# EAGLE design MCS8951 (EAGLE 7.2.0)
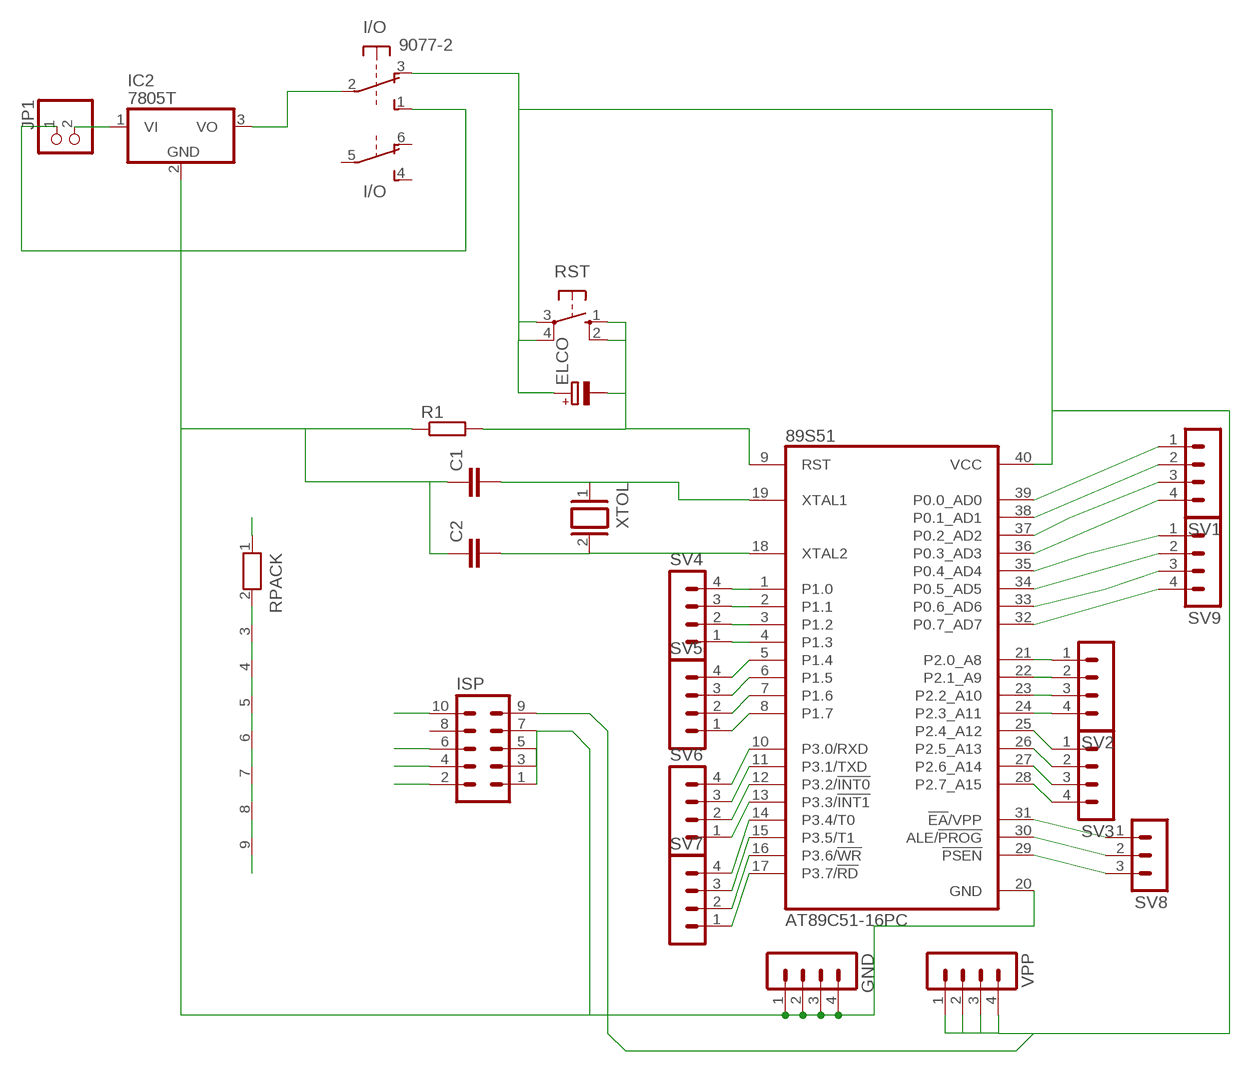
[diagram p0: schematic, sheet 1]

## Parts
89S51  AT89C51-16PC  [DIL40]
C1  C-EU025-030X050  [C025-030X050]
C2  C-EU025-030X050  [C025-030X050]
ELCO  CPOL-EUE5-5  [E5-5]
GND  MA04-1  [MA04-1]
I/O  9077-2  [9077-2]
IC2  7805T  [TO220H]
ISP  MA05-2  [MA05-2]
JP1  PINHD-1X2  [1X02]
R1  R-EU_0207/10  [0207/10]
RPACK  RN08  [RN-9]
RST  10-XX  [B3F-10XX]
SV1  MA04-1  [MA04-1]
SV2  MA04-1  [MA04-1]
SV3  MA04-1  [MA04-1]
SV4  MA04-1  [MA04-1]
SV5  MA04-1  [MA04-1]
SV6  MA04-1  [MA04-1]
SV7  MA04-1  [MA04-1]
SV8  MA03-1  [MA03-1]
SV9  MA04-1  [MA04-1]
VPP  MA04-1  [MA04-1]
XTOL  XTAL/S  [QS]

## Nets
GND: 89S51.20(GND) C1.1 C2.1 GND.1 GND.2 GND.3 GND.4 I/O.1(1:S) IC2.2(GND) ISP.1 ISP.3 ISP.5 ISP.7 JP1.1 R1.1
MISO: 89S51.7(P1.6) ISP.2 SV5.2
MOSI: 89S51.6(P1.5) ISP.10 SV5.3
N$2: I/O.2(1:P) IC2.3(VO)
N$4: 89S51.21(P2.0_A8) SV2.1
N$5: 89S51.22(P2.1_A9) SV2.2
N$6: 89S51.23(P2.2_A10) SV2.3
N$7: 89S51.24(P2.3_A11) SV2.4
N$8: 89S51.25(P2.4_A12) SV3.1
N$9: 89S51.26(P2.5_A13) SV3.2
N$10: 89S51.27(P2.6_A14) SV3.3
N$11: 89S51.28(P2.7_A15) SV3.4
N$12: 89S51.4(P1.3) SV4.1
N$13: 89S51.3(P1.2) SV4.2
N$14: 89S51.2(P1.1) SV4.3
N$15: 89S51.1(P1.0) SV4.4
N$19: 89S51.5(P1.4) SV5.4
N$20: 89S51.13(P3.3/!INT1) SV6.1
N$21: 89S51.12(P3.2/!INT0) SV6.2
N$22: 89S51.11(P3.1/TXD) SV6.3
N$23: 89S51.10(P3.0/RXD) SV6.4
N$24: 89S51.17(P3.7/!RD) SV7.1
N$25: 89S51.16(P3.6/!WR) SV7.2
N$26: 89S51.15(P3.5/T1) SV7.3
N$27: 89S51.14(P3.4/T0) SV7.4
N$28: 89S51.31(!EA!/VPP) SV8.1
N$29: 89S51.30(ALE/!PROG) SV8.2
N$30: 89S51.29(!PSEN) SV8.3
N$37: 89S51.19(XTAL1) C1.2 XTOL.1
N$39: IC2.1(VI) JP1.2
N$44: 89S51.18(XTAL2) C2.2 XTOL.2
R1: 89S51.39(P0.0_AD0) RPACK.2 SV1.1
R2: 89S51.38(P0.1_AD1) RPACK.3 SV1.2
R3: 89S51.37(P0.2_AD2) RPACK.4 SV1.3
R4: 89S51.36(P0.3_AD3) RPACK.5 SV1.4
R5: 89S51.35(P0.4_AD4) RPACK.6 SV9.1
R6: 89S51.34(P0.5_AD5) RPACK.7 SV9.2
R7: 89S51.33(P0.6_AD6) RPACK.8 SV9.3
R8: 89S51.32(P0.7_AD7) RPACK.9 SV9.4
RST: 89S51.9(RST) ELCO.- ISP.6 R1.2 RST.1(S) RST.2(S1)
SCK: 89S51.8(P1.7) ISP.4 SV5.1
VPP: 89S51.40(VCC) ELCO.+ I/O.3(1:O) ISP.9 RPACK.1 RST.3(P) RST.4(P1) VPP.1 VPP.2 VPP.3 VPP.4
Unconnected: I/O.4(2:S) I/O.5(2:P) I/O.6(2:O) ISP.8

## Library data of the parts
89S51 = atmel:AT89C51-*: 8-bit Microcontroller with 4K Bytes Flash Not Recommended for New Designs. Use AT89S51. Source: http://www.atmel.com/dyn/resources/prod_documents/doc0265.; OC_FARNELL: unknown; OC_NEWARK: unknown
C1 C2 = resistor:C-EU: CAPACITOR, European symbol
ELCO = rcl:CPOL-EU: POLARIZED CAPACITOR, European symbol
GND SV1-SV7 SV9 VPP = con-lstb:MA04-1: PIN HEADER; OC_FARNELL: unknown; OC_NEWARK: unknown
I/O = switch-misc:9077-2: MARQUARDT SWITCH 9077.0200 Distributor: Buerklin <https://www.buerklin.com/default.asp?event=ShowArtikel%2812G2822%29&l=d&jump=ArtNr_12G2822>
IC2 = linear:78*: Positive VOLTAGE REGULATOR Source: http://cache.national.com/ds/LM/LM78L05.pdf http://www.fairchildsemi.com/ds/LM/LM7805.pdf
ISP = con-lstb:MA05-2: PIN HEADER; OC_FARNELL: unknown; OC_NEWARK: unknown
JP1 = pinhead:PINHD-1X2: PIN HEADER
R1 = resistor:R-EU_: RESISTOR, European symbol
RPACK = resistor-net:RN08: RESISTOR NETWORK; OC_FARNELL: unknown; OC_NEWARK: unknown
RST = switch-omron:10-XX: OMRON SWITCH; MPN: B3F-1000; OC_FARNELL: 176432; OC_NEWARK: 36M3542
SV8 = con-lstb:MA03-1: PIN HEADER; OC_FARNELL: unknown; OC_NEWARK: unknown
XTOL = special:XTAL/S: CRYSTAL

## Net classes
0 default: width 0.406 mm

## Board
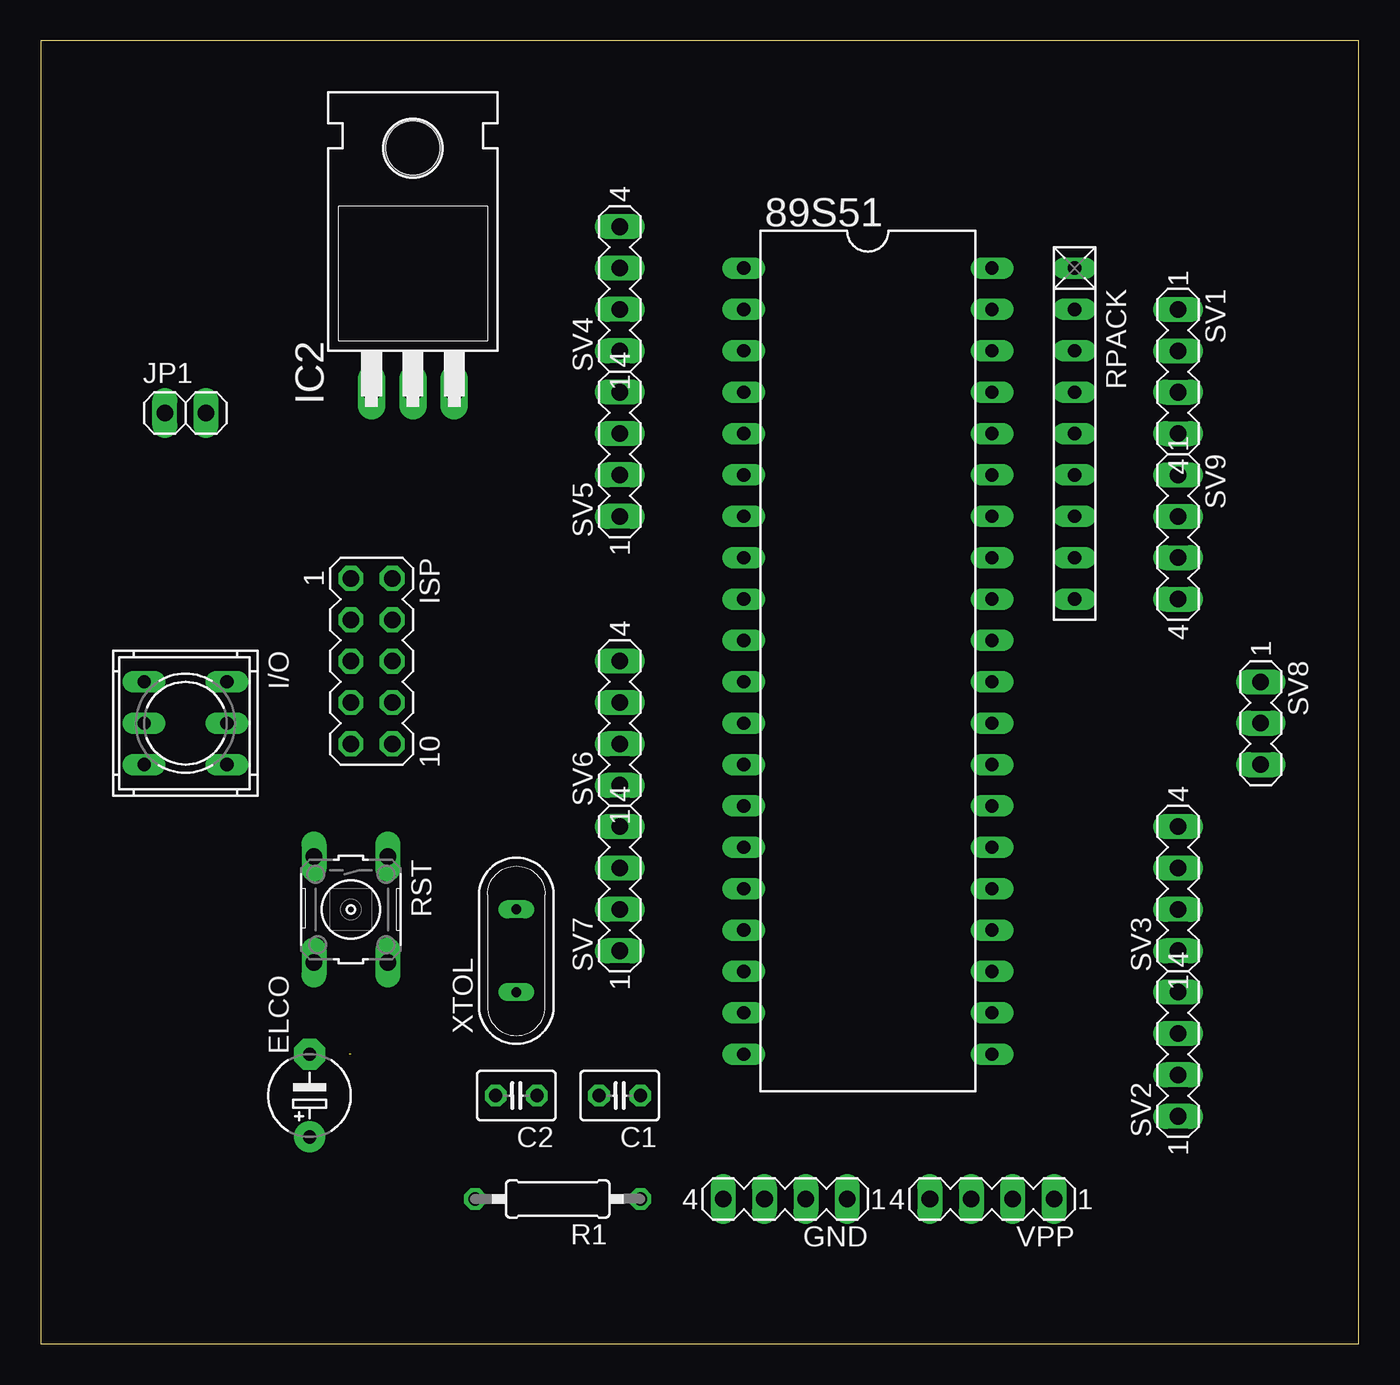
[diagram p1: board, top side]
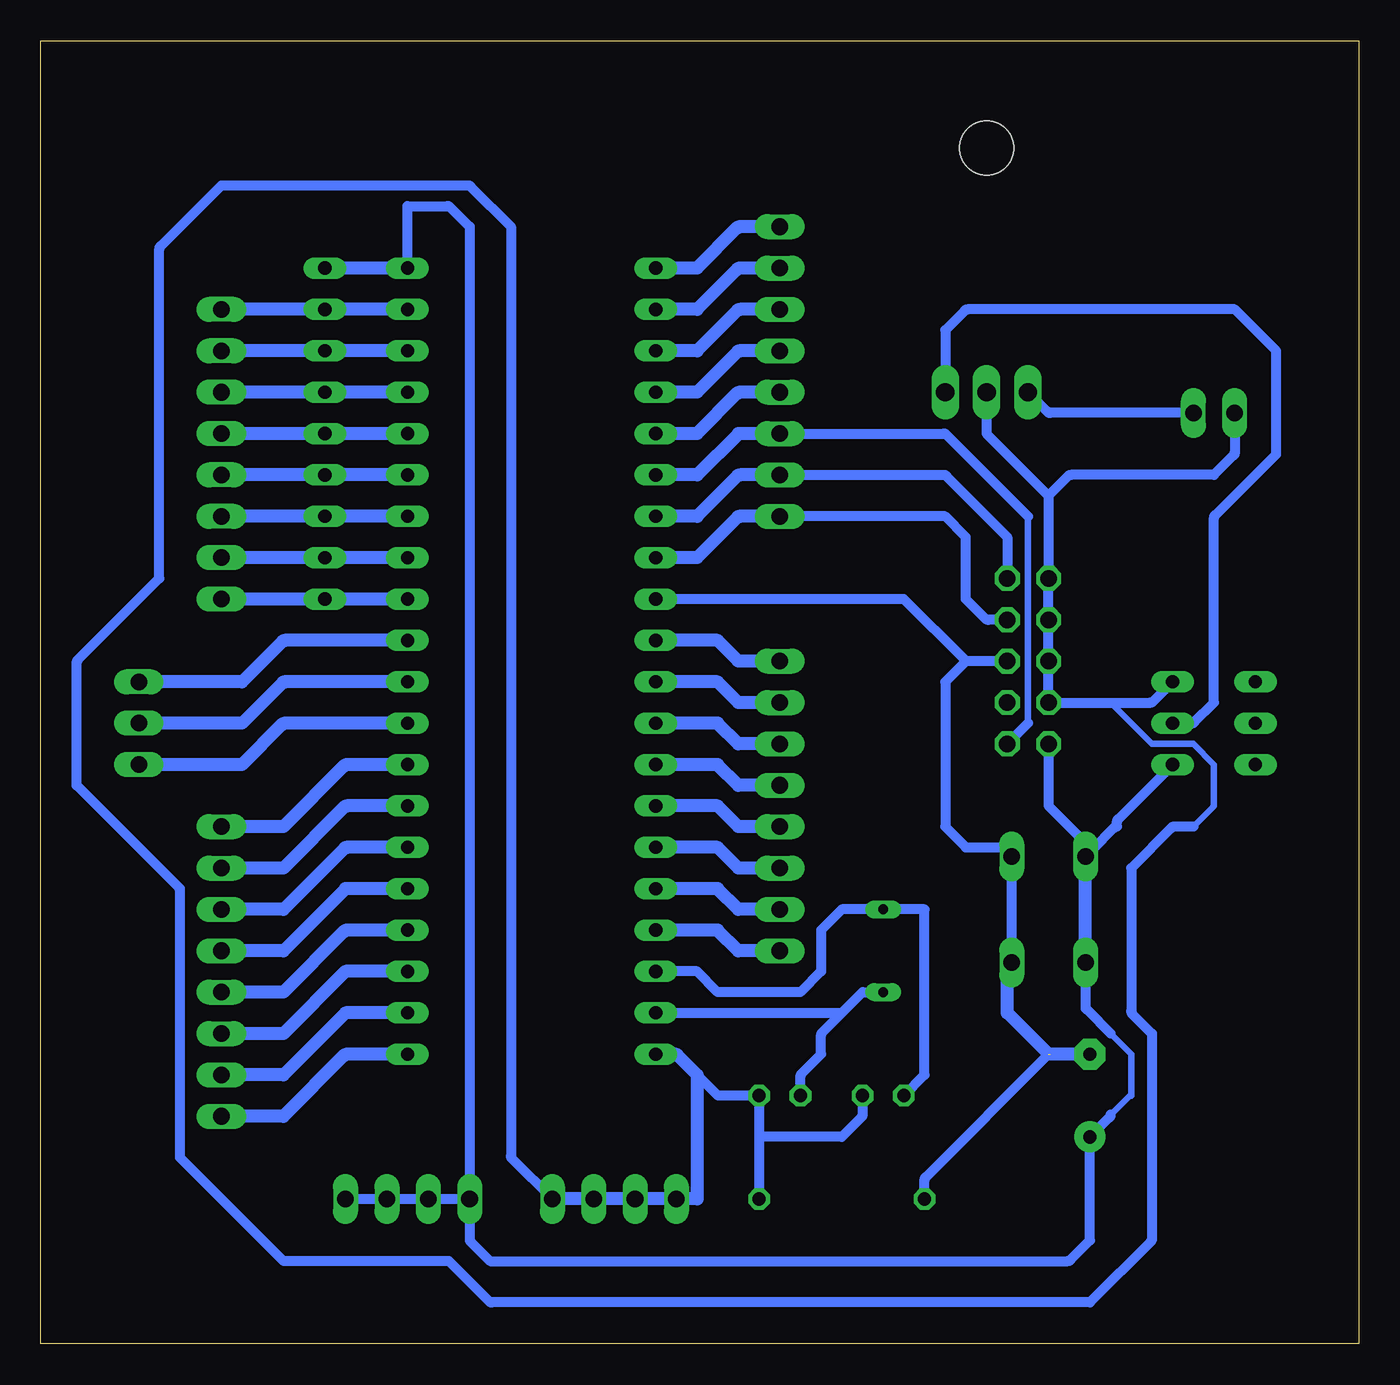
[diagram p2: board, bottom side, seen from below]

Size 80.95 x 80 mm. Coordinates in mm from the lower left corner, seen from the top.
Outline: 0,0 80.95,0 80.95,80 0,80 0,0
Copper layers (1*16): Top 0.035mm / dielectric 1.5mm / Bottom 0.035mm
Design rules "default": minimum track width 10mil, minimum drill 24mil, track to track 8mil, track to pad 8mil, pad to pad 8mil, via to via 8mil, smd to smd 8mil, copper to edge 40mil, drill to drill 8mil, minimum pad ring 10mil, minimum via ring 8mil, stop-mask expansion 4mil, vias tented up to drill 0mil, thermal gap 10mil

### Footprints (pad centres in the part's own frame; a part is rotated, then mirrored left to right if it is on the bottom)
DIL40 = drill 0.813 long: 1 -24.13,-7.62; 2 -21.59,-7.62; 3 -19.05,-7.62; 4 -16.51,-7.62; 5 -13.97,-7.62; 6 -11.43,-7.62; 7 -8.89,-7.62; 8 -6.35,-7.62; 9 -3.81,-7.62; 10 -1.27,-7.62; 11 1.27,-7.62; 12 3.81,-7.62; 13 6.35,-7.62; 14 8.89,-7.62; 15 11.43,-7.62; 16 13.97,-7.62; 17 16.51,-7.62; 18 19.05,-7.62; 19 21.59,-7.62; 20 24.13,-7.62; 21 24.13,7.62; 22 21.59,7.62; 23 19.05,7.62; 24 16.51,7.62; 25 13.97,7.62; 26 11.43,7.62; 27 8.89,7.62; 28 6.35,7.62; 29 3.81,7.62; 30 1.27,7.62; 31 -1.27,7.62; 32 -3.81,7.62; 33 -6.35,7.62; 34 -8.89,7.62; 35 -11.43,7.62; 36 -13.97,7.62; 37 -16.51,7.62; 38 -19.05,7.62; 39 -21.59,7.62; 40 -24.13,7.62
C025-030X050 = drill 0.813 octagon: 1 -1.27,0; 2 1.27,0
E5-5 = drill 0.813 pad 1.905: + -2.54,0 | drill 0.813 pad 1.905 octagon: - 2.54,0
MA04-1 = drill 1.016 long: 1 -3.81,0; 2 -1.27,0; 3 1.27,0; 4 3.81,0
9077-2 = drill 0.813 long: 1 -2.54,2.54; 2 0,2.54; 3 2.54,2.54; 4 -2.54,-2.54; 5 0,-2.54; 6 2.54,-2.54
TO220H = drill 1.118 long: 1 -2.54,-10.16; 2 0,-10.16; 3 2.54,-10.16 | hole 3.302: 0,4.826
MA05-2 = drill 1.016 octagon: 1 -5.08,-1.27; 2 -5.08,1.27; 3 -2.54,-1.27; 4 -2.54,1.27; 5 0,-1.27; 6 0,1.27; 7 2.54,-1.27; 8 2.54,1.27; 9 5.08,-1.27; 10 5.08,1.27
1X02 = drill 1.016 long: 1 -1.27,0; 2 1.27,0
0207/10 = drill 0.813 octagon: 1 -5.08,0; 2 5.08,0
RN-9 = drill 0.813 long: 1 -10.16,0; 2 -7.62,0; 3 -5.08,0; 4 -2.54,0; 5 0,0; 6 2.54,0; 7 5.08,0; 8 7.62,0; 9 10.16,0
B3F-10XX = drill 1.016 long: 1 -3.251,2.261; 2 3.251,2.261; 3 -3.251,-2.261; 4 3.251,-2.261
MA03-1 = drill 1.016 long: 1 -2.54,0; 2 0,0; 3 2.54,0
QS = drill 0.61 long: 1 -2.54,0; 2 2.54,0

### Placement (x,y rotation side)
89S51  50.8,41.91 270 top
C1  35.56,15.24 180 top
C2  29.21,15.24 180 top
ELCO  16.51,15.24 90 top
GND  45.72,8.89 180 top
I/O  8.89,38.1 270 top
IC2  22.86,68.58 0 top
ISP  20.32,41.91 270 top
JP1  8.89,57.15 0 top
R1  31.75,8.89 180 top
RPACK  63.5,55.88 270 top
RST  19.05,26.67 270 top
SV1  69.85,59.69 270 top
SV2  69.85,17.78 90 top
SV3  69.85,27.94 90 top
SV4  35.56,64.77 90 top
SV5  35.56,54.61 90 top
SV6  35.56,38.1 90 top
SV7  35.56,27.94 90 top
SV8  74.93,38.1 270 top
SV9  69.85,49.53 270 top
VPP  58.42,8.89 180 top
XTOL  29.21,24.13 90 top

### Tracks (layer width: path | path; a pad name or v marks a point on that pad's centre or on a via)
GND
  Bottom 0.406: ISP.7 15.35,39.37 arc45 15.17,39.3 12.7,36.83 10.16,36.83 8.89,35.56 8.89,33.12 arc45 8.96,32.95 10.16,31.75
  Bottom 0.61: IC2.2 22.86,55.88 19.05,52.07 | 19.05,52.07 ISP.1 ISP.3 ISP.5 ISP.7 12.8,39.37 arc-45 12.63,39.44 I/O.1 | JP1.1 7.62,54.72 arc45 7.69,54.54 8.89,53.34 17.68,53.34 arc-45 17.85,53.27 19.05,52.07 | 40.64,16.51 39.44,15.31 arc-45 39.27,15.24 C1.1 36.83,12.7 | 36.83,12.7 R1.1 | C2.1 30.48,14.07 arc45 30.55,13.9 31.75,12.7 36.83,12.7 | 10.16,31.75 11.32,31.75 arc-45 11.5,31.68 13.97,29.21 13.97,20.43 arc-45 13.9,20.25 12.7,19.05 12.7,6.46 arc45 12.77,6.28 16.51,2.54 53.23,2.54 arc45 53.41,2.61 55.88,5.08 65.94,5.08 arc45 66.11,5.15 72.39,11.43 72.39,27.84 arc-45 72.46,28.01 78.74,34.29 78.74,41.8 arc45 78.67,41.98 73.66,46.99 73.66,67.2 arc45 73.59,67.38 69.85,71.12 54.72,71.12 arc45 54.54,71.05 52.07,68.58 52.07,11.54 arc-45 52,11.36 GND.1
  Bottom 0.813: 89S51.20 42.02,17.78 arc45 41.84,17.71 40.64,16.51 40.64,8.89 GND.4 GND.3 GND.2 GND.1
MISO
  Bottom 0.61: SV5.2 25.5,53.34 arc45 25.33,53.27 21.59,49.53 ISP.2
  Bottom 0.813: SV5.2 37.99,53.34 arc-45 38.17,53.27 40.64,50.8 89S51.7
MOSI
  Bottom 0.406: 20.32,50.8 20.32,38.1
  Bottom 0.61: SV5.3 25.5,55.88 arc45 25.33,55.81 20.32,50.8 | 20.32,38.1 ISP.10
  Bottom 0.813: SV5.3 38.1,55.88 40.64,53.34 89S51.6
N$2
  Bottom 0.61: I/O.2 10.27,38.1 arc-45 10.09,38.17 8.89,39.37 8.89,50.7 arc45 8.82,50.87 5.08,54.61 5.08,60.96 7.62,63.5 24.02,63.5 arc-45 24.2,63.43 25.4,62.23 IC2.3
N$4
  Bottom 0.813: 89S51.21 62.12,17.78 arc-45 62.3,17.71 66.04,13.97 SV2.1
N$5
  Bottom 0.813: 89S51.22 62.23,20.32 66.04,16.51 SV2.2
N$6
  Bottom 0.813: 89S51.23 62.23,22.86 66.04,19.05 SV2.3
N$7
  Bottom 0.813: 89S51.24 62.12,25.4 arc-45 62.3,25.33 66.04,21.59 SV2.4
N$8
  Bottom 0.813: 89S51.25 62.23,27.94 66.04,24.13 SV3.1
N$9
  Bottom 0.813: 89S51.26 62.12,30.48 arc-45 62.3,30.41 66.04,26.67 SV3.2
N$10
  Bottom 0.813: 89S51.27 62.12,33.02 arc-45 62.3,32.95 66.04,29.21 SV3.3
N$11
  Bottom 0.813: 89S51.28 62.12,35.56 arc-45 62.3,35.49 66.04,31.75 SV3.4
N$12
  Bottom 0.813: SV4.1 37.99,60.96 arc-45 38.17,60.89 40.64,58.42 89S51.4
N$13
  Bottom 0.813: SV4.2 37.99,63.5 arc-45 38.17,63.43 40.64,60.96 89S51.3
N$14
  Bottom 0.813: SV4.3 37.99,66.04 arc-45 38.17,65.97 40.64,63.5 89S51.2
N$15
  Bottom 0.813: SV4.4 37.99,68.58 arc-45 38.17,68.51 40.64,66.04 89S51.1
N$19
  Bottom 0.813: SV5.4 37.99,58.42 arc-45 38.17,58.35 40.64,55.88 89S51.5
N$20
  Bottom 0.813: SV6.1 38.1,34.29 39.37,35.56 89S51.13
N$21
  Bottom 0.813: SV6.2 38.1,36.83 39.37,38.1 89S51.12
N$22
  Bottom 0.813: SV6.3 38.1,39.37 39.37,40.64 89S51.11
N$23
  Bottom 0.813: SV6.4 37.99,41.91 arc45 38.17,41.98 39.37,43.18 89S51.10
N$24
  Bottom 0.813: SV7.1 38.1,24.13 39.37,25.4 89S51.17
N$25
  Bottom 0.813: SV7.2 38.1,26.67 39.37,27.94 89S51.16
N$26
  Bottom 0.813: SV7.3 38.1,29.21 39.37,30.48 89S51.15
N$27
  Bottom 0.813: SV7.4 38.1,31.75 39.37,33.02 89S51.14
N$28
  Bottom 0.813: 89S51.31 65.94,43.18 arc-45 66.11,43.11 68.58,40.64 SV8.1
N$29
  Bottom 0.813: 89S51.30 65.94,40.64 arc-45 66.11,40.57 68.58,38.1 SV8.2
N$30
  Bottom 0.813: 89S51.29 65.94,38.1 arc-45 66.11,38.03 68.58,35.56 SV8.3
N$37
  Bottom 0.61: 89S51.19 31.75,20.32 | 31.75,20.32 30.48,21.59 XTOL.1 | C1.2 34.29,16.41 arc45 34.22,16.58 33.02,17.78 33.02,18.95 arc45 32.95,19.12 31.75,20.32
N$39
  Bottom 0.61: JP1.2 18.95,57.15 arc45 19.12,57.22 IC2.1
N$44
  Bottom 0.61: 89S51.18 40.64,22.86 39.37,21.59 34.29,21.59 33.02,22.86 33.02,25.4 31.75,26.67 XTOL.2 26.67,26.67 26.67,16.51 C2.2
R1
  Bottom 0.813: 89S51.39 RPACK.2 SV1.1
R2
  Bottom 0.813: 89S51.38 RPACK.3 SV1.2
R3
  Bottom 0.813: 89S51.37 RPACK.4 SV1.3
R4
  Bottom 0.813: 89S51.36 RPACK.5 SV1.4
R5
  Bottom 0.813: 89S51.35 RPACK.6 SV9.1
R6
  Bottom 0.813: 89S51.34 RPACK.7 SV9.2
R7
  Bottom 0.813: 89S51.33 RPACK.8 SV9.3
R8
  Bottom 0.813: 89S51.32 RPACK.9 SV9.4
RST  (1 unrouted)
  Bottom 0.61: RST.2 RST.1 21.8,30.41 arc-45 21.98,30.48 24.13,30.48 25.4,31.75 25.4,40.64 24.13,41.91 ISP.6 24.02,41.91 arc45 24.2,41.98 27.94,45.72 89S51.9 | R1.2 26.67,10.05 arc45 26.6,10.23 19.05,17.78
  Bottom 0.813: ELCO.- 18.95,17.78 arc45 19.12,17.85 21.59,20.32 21.59,23.03 arc45 21.52,23.21 RST.2
SCK
  Bottom 0.61: ISP.4 22.75,44.45 arc45 22.93,44.52 24.13,45.72 24.13,49.53 25.4,50.8 SV5.1
  Bottom 0.813: SV5.1 37.99,50.8 arc-45 38.17,50.73 40.64,48.26 89S51.8
VPP
  Bottom 0.406: 15.24,19.05 13.97,17.78 13.97,15.24 14.07,15.24 15.24,14.07
  Bottom 0.61: VPP.1 VPP.2 VPP.3 VPP.4 | 89S51.40 58.42,69.85 55.98,69.85 arc45 55.81,69.78 54.61,68.58 VPP.4 | 16.37,30.34 15.04,31.68 arc45 14.86,31.75 14.86,32.03 arc45 14.78,32.21 I/O.3 | 16.37,30.34 RST.3 | ISP.9 19.05,33.12 arc-45 18.98,32.95 16.37,30.34 | VPP.4 54.61,6.46 arc-45 54.54,6.28 53.34,5.08 17.89,5.08 arc-45 17.71,5.15 16.51,6.35 ELCO.+ 15.31,13.9 arc-45 15.24,14.07 | RST.4 16.79,20.7 arc-45 16.71,20.52 15.24,19.05
  Bottom 0.813: 89S51.40 RPACK.1 | RST.4 RST.3